# EAGLE schematic avrmf (EAGLE 6.5.0)
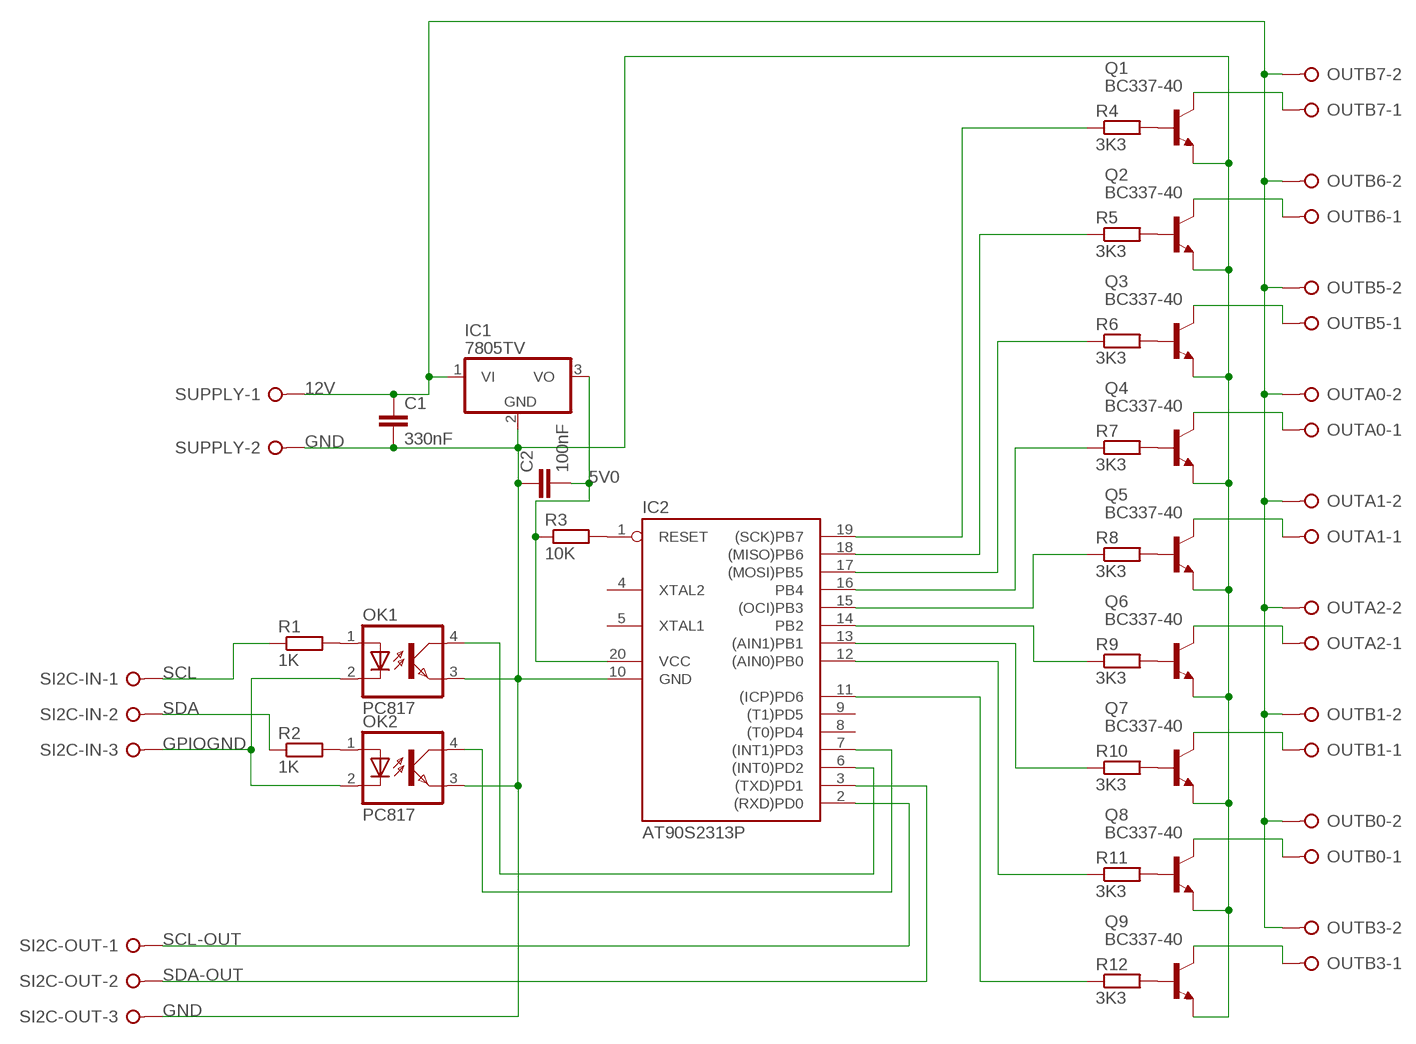
[diagram p0: schematic, sheet 1]

## Parts
C1  330nF  C2,5-3  [C2.5-3]
C2  100nF  C2,5-3  [C2.5-3]
IC1  7805TV  [TO220V]
IC2  AT90S2313P  [DIL20]
OK1  PC817  [DIL04]
OK2  PC817  [DIL04]
OUTA0  W237-02P  [W237-132]
OUTA1  W237-02P  [W237-132]
OUTA2  W237-02P  [W237-132]
OUTB0  W237-02P  [W237-132]
OUTB1  W237-02P  [W237-132]
OUTB3  W237-02P  [W237-132]
OUTB5  W237-02P  [W237-132]
OUTB6  W237-02P  [W237-132]
OUTB7  W237-02P  [W237-132]
Q1  BC337-40  [TO92]
Q2  BC337-40  [TO92]
Q3  BC337-40  [TO92]
Q4  BC337-40  [TO92]
Q5  BC337-40  [TO92]
Q6  BC337-40  [TO92]
Q7  BC337-40  [TO92]
Q8  BC337-40  [TO92]
Q9  BC337-40  [TO92]
R1  1K  R-EU_0207/10  [0207/10]
R2  1K  R-EU_0207/10  [0207/10]
R3  10K  R-EU_0207/10  [0207/10]
R4  3K3  R-EU_0207/10  [0207/10]
R5  3K3  R-EU_0207/10  [0207/10]
R6  3K3  R-EU_0207/10  [0207/10]
R7  3K3  R-EU_0207/10  [0207/10]
R8  3K3  R-EU_0207/10  [0207/10]
R9  3K3  R-EU_0207/10  [0207/10]
R10  3K3  R-EU_0207/10  [0207/10]
R11  3K3  R-EU_0207/10  [0207/10]
R12  3K3  R-EU_0207/10  [0207/10]
SI2C-IN  W237-3E  [W237-3E]
SI2C-OUT  W237-3E  [W237-3E]
SUPPLY  W237-02P  [W237-132]

## Nets
5V0: C2.2 IC1.3(VO) IC2.20(VCC) R3.1
12V: C1.1 IC1.1(VI) OUTA0.2 OUTA1.2 OUTA2.2 OUTB0.2 OUTB1.2 OUTB3.2 OUTB5.2 OUTB6.2 OUTB7.2 SUPPLY.1
GND: C1.2 C2.1 IC1.2(GND) IC2.10(GND) OK1.3(EMIT) OK2.3(EMIT) Q1.1(E) Q2.1(E) Q3.1(E) Q4.1(E) Q5.1(E) Q6.1(E) Q7.1(E) Q8.1(E) Q9.1(E) SI2C-OUT.3 SUPPLY.2
GPIOGND: OK1.2(C) OK2.2(C) SI2C-IN.3
N$1: OK1.1(A) R1.2
N$2: IC2.1(RESET) R3.2
N$4: OK2.1(A) R2.2
N$5: Q1.2(B) R4.2
N$6: OUTB7.1 Q1.3(C)
N$7: IC2.19((SCK)PB7) R4.1
N$8: IC2.7((INT1)PD3) OK2.4(COL)
N$10: IC2.6((INT0)PD2) OK1.4(COL)
N$14: Q9.2(B) R12.2
N$15: Q7.2(B) R10.2
N$16: Q6.2(B) R9.2
N$17: Q5.2(B) R8.2
N$18: Q4.2(B) R7.2
N$19: Q3.2(B) R6.2
N$20: Q2.2(B) R5.2
N$22: Q8.2(B) R11.2
N$27: IC2.11((ICP)PD6) R12.1
N$28: IC2.12((AIN0)PB0) R11.1
N$29: IC2.13((AIN1)PB1) R10.1
N$30: IC2.14(PB2) R9.1
N$31: IC2.15((OCI)PB3) R8.1
N$32: IC2.16(PB4) R7.1
N$33: IC2.17((MOSI)PB5) R6.1
N$34: IC2.18((MISO)PB6) R5.1
N$41: OUTB3.1 Q9.3(C)
N$42: OUTB0.1 Q8.3(C)
N$43: OUTB1.1 Q7.3(C)
N$44: OUTA2.1 Q6.3(C)
N$45: OUTA1.1 Q5.3(C)
N$46: OUTA0.1 Q4.3(C)
N$47: OUTB5.1 Q3.3(C)
N$48: OUTB6.1 Q2.3(C)
SCL: R1.1 SI2C-IN.1
SCL-OUT: IC2.2((RXD)PD0) SI2C-OUT.1
SDA: R2.1 SI2C-IN.2
SDA-OUT: IC2.3((TXD)PD1) SI2C-OUT.2
Unconnected: IC2.4(XTAL2) IC2.5(XTAL1) IC2.8((T0)PD4) IC2.9((T1)PD5)

## Library data of the parts
C1 C2 = capacitor-wima:C: CAPACITOR naming: grid - package width
IC1 = linear:78*: Positive VOLTAGE REGULATOR Source: http://cache.national.com/ds/LM/LM78L05.pdf http://www.fairchildsemi.com/ds/LM/LM7805.pdf
IC2 = atmel:AT90S2313: MICROCONTROLLER 2 Kbytes FLASH 128 bytes SRAM 128 bytes EEPROM UART; OC_FARNELL: unknown; OC_NEWARK: unknown
OK1 OK2 = optocoupler:PC817: SHARP OPTO COUPLER; MPN: PC817X4J000F; OC_FARNELL: 9707727; OC_NEWARK: 97K7059
OUTA0 OUTA1 OUTA2 OUTB0 OUTB1 OUTB3 OUTB5-OUTB7 SUPPLY = con-wago-508:W237-02P: WAGO SREW CLAMP; OC_FARNELL: unknown; OC_NEWARK: unknown
Q1-Q9 = transistor-npn:BC337*: NPN Transistor
R1-R12 = resistor:R-EU_: RESISTOR, European symbol
SI2C-IN SI2C-OUT = con-wago-508:W237-3E: WAGO SREW CLAMP; OC_FARNELL: unknown; OC_NEWARK: unknown